# Altium schematic sheet M3-LCD.SchDoc
size A4; ApprovedBy: -; CheckedBy: h.t.t.monfared; Author: h.t.t.monfared; Engineer: h.t.t.monfared; DocumentNumber: 1; Revision: 1.00; SheetNumber: 3; SheetTotal: 10; Project Code:: UFM Sensor Controller; Document Title:: OLED Sheet
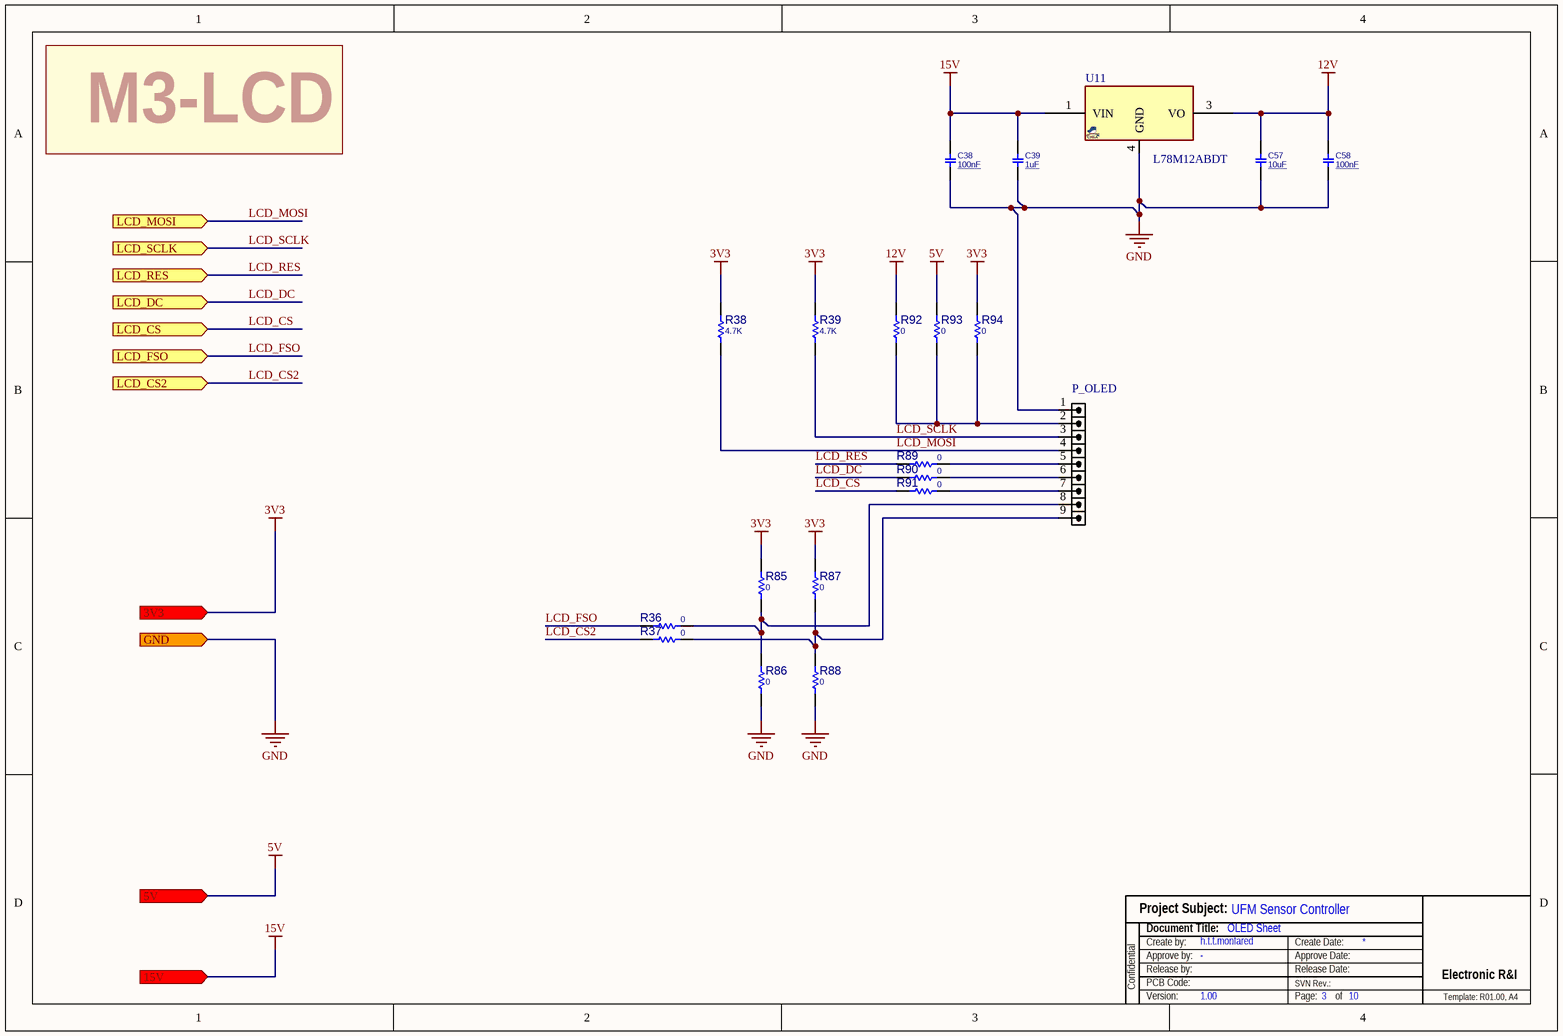
[diagram p0: M3-LCD.SchDoc]

## Parts
C38  100nF  [C1206]
C39  1uF  [C1206]
C57  10uF  [C1206]
C58  100nF  [C1206]
P_OLED  HDR1X9  [TMS9]  (value not drawn)
R36  0  [R1206]
R37  0  [R1206]
R38  4.7K  [R1206]
R39  4.7K  [R1206]
R85  0  [R1206]
R86  0  [R1206]
R87  0  [R1206]
R88  0  [R1206]
R89  0  [R1206]
R90  0  [R1206]
R91  0  [R1206]
R92  0  [R1206]
R93  0  [R1206]
R94  0  [R1206]
U11  L78M12ABDT  [DPAK_3]

## Ports
3V3 (in), 5V (in), 15V (in), GND (in), LCD_CS2 (in), LCD_CS (in), LCD_DC (in), LCD_FSO (in), LCD_MOSI (in), LCD_RES (in), LCD_SCLK (in)

## Nets
3V3: R38.1 R39.1 R85.2 R87.2 R94.2 ; port 3V3
5V: R93.2 ; port 5V
12V: C57.2 C58.2 R92.2 U11.3(VO)
15V: C38.2 C39.2 U11.1(VIN) ; port 15V
GND: C38.1 C39.1 C57.1 C58.1 P_OLED.1 R86.1 R88.1 U11.4(GND) ; port GND
LCD_CS: R91.1 ; port LCD_CS
LCD_CS2: R37.2 ; port LCD_CS2
LCD_DC: R90.1 ; port LCD_DC
LCD_FSO: R36.2 ; port LCD_FSO
LCD_MOSI: P_OLED.4 R38.2 ; port LCD_MOSI
LCD_RES: R89.1 ; port LCD_RES
LCD_SCLK: P_OLED.3 R39.2 ; port LCD_SCLK
NetP_OLED_2: P_OLED.2 R92.1 R93.1 R94.1
NetP_OLED_5: P_OLED.5 R89.2
NetP_OLED_6: P_OLED.6 R90.2
NetP_OLED_7: P_OLED.7 R91.2
NetP_OLED_8: P_OLED.8 R36.1 R85.1 R86.2
NetP_OLED_9: P_OLED.9 R37.1 R87.1 R88.2

## Notes on the sheet
- M3-LCD
- Project Subject:
- Confidential
- Release by:
- Document Title:
- Create by:
- PCB Code:
- Approve by:
- SVN Rev.:
- Create Date:
- Release Date:
- Approve Date:
- Electronic R&I
- Version:
- Page:
- of
- Template: R01.00, A4

## Library data of the parts
C38 C39 C57 C58 = CAP_SMD_MLCC: CAP, MLCC, 1nF, 50V, C0G, 10%, 0402; MANF_P#: MANF_PART#; MANF: Murata; PARAM: C0G, 10%; PRICE: 100= 1$; DESC: CAP, MLCC, 1nF, 50V, C0G, 10%, 0402; PARAM2: 50V; ASSEMBLY: ASSEMBLY
  C38 C58: VALUE: 100nF
  C39: VALUE: 1uF
  C57: VALUE: 10uF
P_OLED = HDR_M_1X9: CONN, HEADER, Male, pitch: 2.54mm, 9POS; VALUE: HDRM9
R36-R39 R85-R94 = RES_SMD: RESISTOR, SMD; PARAM: -W; DESC: DESCRIPTION; DIST#: MOUSER; PARAM2: 1%; MANF_P#: -; MANF: -; ASSEMBLY: ASSEMBLY; PRICE: 100= 0.5$
  R36 R37 R85-R94: VALUE: 0
  R38 R39: VALUE: 4.7K
U11 = VREG_78M12_TO252: REG, Linear, Fixed, 12v, 0.5A, TO-252; MANF_P#: MC78M12CDT, UA78M12CKV, MC78M12ABDT, L78M12CDT, MC78M12BDT, BA78M12FP, TS78M12CP; MANF: TI, ST, ON, ROHM, TS; PARAM: 12v, 0.5A; PARAM2: PARAM2; VALUE: L78M12ABDT